# EasyEDA Pro project tumkibot1_relay_module.eprj

# Schematic Schematic1
Board Name: Board1; Create Date: 2025-09-21; Page Name: P1; Project Name: tumkibot1_relay_module; Schematic Name: Schematic1; Update Date: 2025-09-22; Company: EasyEDA.com; Page Size: A4; Version: V1.0
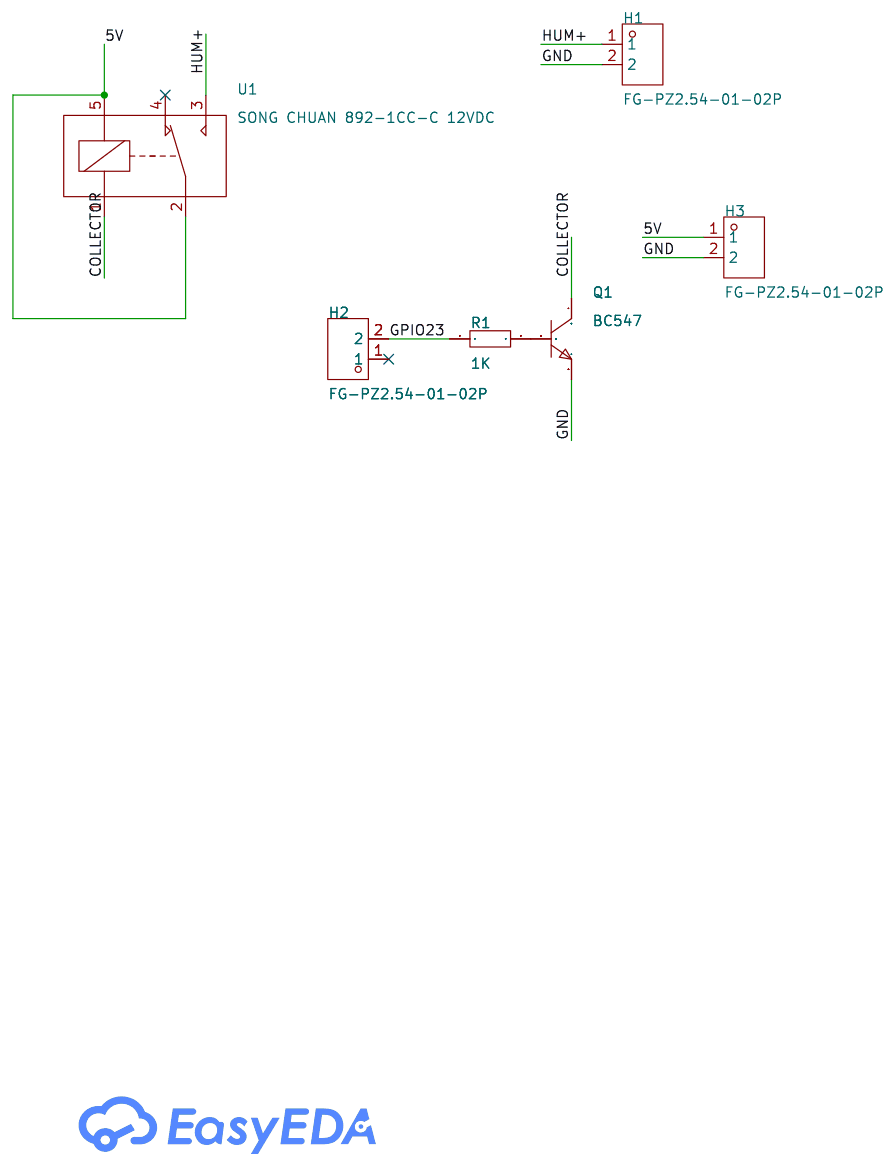
[diagram p0: schematic sheet]

## Parts
H1  FG-PZ2.54-01-02P  [HDR-TH_2P-P2.54-V-M]
H2  FG-PZ2.54-01-02P  [HDR-TH_2P-P2.54-V-M]
H3  FG-PZ2.54-01-02P  [HDR-TH_2P-P2.54-V-M]
Q1  BC547  [TO-92-3_L4.9-W3.7-P1.27-L]
R1  10K  [R0603]
U1  SONG CHUAN 892-1CC-C 12VDC  [RELAY_SPDT_892-1CC-C]

## Library data of the parts
H1-H3 = FG-PZ2.54-01-02P: LCSC Part Name: 1x2P 间距:2.54mm 方针; Supplier Part: C42391436; Manufacturer: FG(富港); Supplier Footprint: 插件,P=2.54mm; JLCPCB Part Class: Extended Part; Datasheet: https://item.szlcsc.com/datasheet/FG-PZ2.54-01-02P/44326031.html; Supplier: LCSC; Pin Structure: 1x2P; Pitch: 2.54mm; Circluar Pins/Square Pins: Pin Header; Number of Rows: 1
Q1 = BC547: Supplier Part: C47089404; Manufacturer: CJ(江苏长电/长晶); Supplier Footprint: TO-92; JLCPCB Part Class: Extended Part; Datasheet: https://item.szlcsc.com/datasheet/BC547/49277194.html; Supplier: LCSC; type: NPN; Current - Collector(Ic): 100mA; Collector - Emitter Voltage VCEO: 45V; Pd - Power Dissipation: 625mW; DC Current Gain: 800@5V,2mA; Transition frequency(fT): 150MHz; Current - Collector Cutoff: 100nA; Vce Saturation(VCE(sat)): 300mV@100mA,5mA; Operating Temperature: -55℃~+150℃; Emitter-Base Voltage(Vebo): 6V; Number: 1 NPN
R1 = Res_0603: Supplier Footprint: 0603
U1 = SONG CHUAN 892-1CC-C 12VDC: Supplier Part: C9900028967; Supplier Footprint: SPDT; Supplier: LCSC

## Nets
5V: H3.1 U1.2 U1.5
GND: H1.2 H3.2 Q1.3(E)
COLLECTOR: Q1.1(C) U1.1
GPIO23: H2.2 R1.1
HUM+: H1.1 U1.3
$1N469: Q1.2(B) R1.2

Not connected (* = marked no-connect by the designer): H2 1*; U1 4*

# Board PCB1
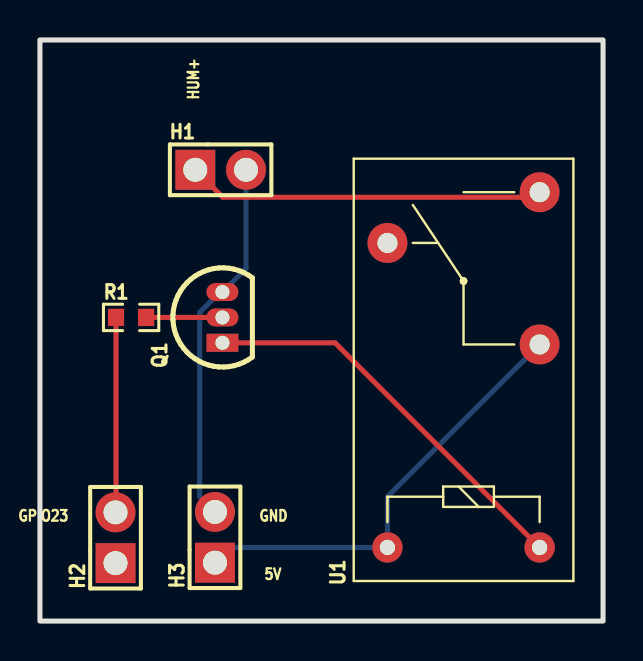
[diagram p1: board, top side]
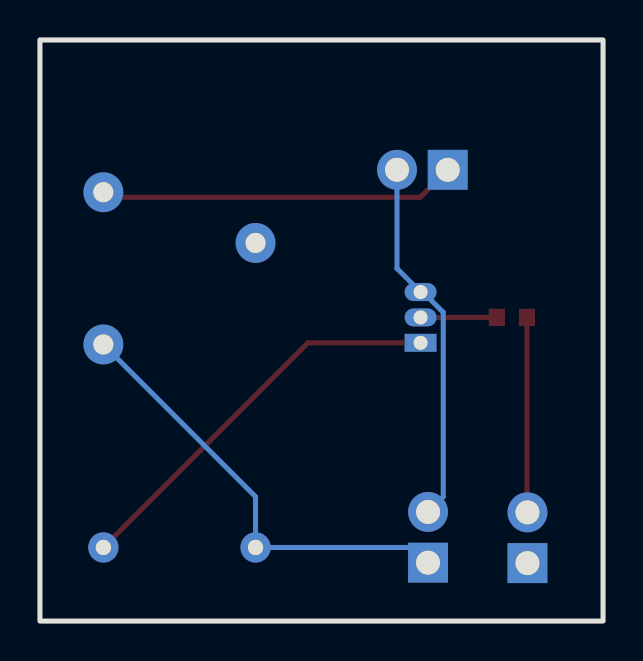
[diagram p2: board, bottom side, seen from below]

Outline 28.19 x 29.08 mm; copper layers: Top Layer, Bottom Layer. Coordinates in mm from the lower left corner of the outline.
Outline path: rectangle 0,29.08 28.19,0
Stack: Top Layer 0.035mm / Dielectric1 1.51mm FR4 er 4.5 / Bottom Layer 0.035mm

## Design rules (mm)
template: JLCPCB Capability(Two Layers Board)
spacing copperThickness1oz (default): track to track 0.102, other pairs 0.152 to 0.3
spacing copperThickness2oz: track to track 0.203, other pairs 0.152 to 0.3
track width copperThickness1oz (default): min 0.127, default 0.254, max 2.54
track width copperThickness2oz: min 0.203, default 0.254, max 2.54
differential pair differentialPair (default): width min 0.127, default 0.254, max 2.54; gap min 0.152, default 0.152
via viaSize (default): diameter min 0.5, default 0.61, max 10; hole min 0.3, default 0.305, max 6.3

## Placement (name value [footprint] x y rotation side)
H1  FG-PZ2.54-01-02P  [HDR-TH_2P-P2.54-V-M]  9.05 22.58 0 top
H2  FG-PZ2.54-01-02P  [HDR-TH_2P-P2.54-V-M]  3.78 4.17 90 top
H3  FG-PZ2.54-01-02P  [HDR-TH_2P-P2.54-V-M]  8.76 4.19 90 top
Q1  BC547  [TO-92-3_L4.9-W3.7-P1.27-L]  9.14 15.2 90 top
R1  10K  [R0603]  4.56 15.2 0 top
U1  SONG CHUAN 892-1CC-C 12VDC  [RELAY_SPDT_892-1CC-C]  21.21 12.57 90 top

## Footprints (pads in the part's own frame, mm; a bottom-side part is the same pattern mirrored in y, then rotated)
HDR-TH_2P-P2.54-V-M
  rect 2x2 hole 1.2: 1(-1.27,0)
  round 2 hole 1.2: 2(1.27,0)
R0603
  rect 0.806x0.864 smd: 1(-0.753,0) 2(0.753,0)
RELAY_SPDT_892-1CC-C
  round 1.52 hole 0.765x0.76: 1(-8.89,-3.81) 5(-8.89,3.81)
  round 2 hole 1.005x1: 2(1.27,-3.81) 3(8.89,-3.81) 4(6.35,3.81)
TO-92-3_L4.9-W3.7-P1.27-L
  rect 0.9x1.6 hole 0.7: 1(-1.27,0)
  oval 0.9x1.6 hole 0.7: 2(0,0) 3(1.27,0)

## Nets
As in the schematic.

Pads without a net: H2 1; U1 4

## Routing (per net, layer and track width the routed paths; a pad name or vN(x,y) marks a point on that pad's centre or on a via; arc(x,y) is an arc through that point)
5V: length 22.3
  Bottom Layer w0.254: U1.2 17.4,6.22 U1.5 9.53,3.68 H3.1
GND: length 18.5
  Bottom Layer w0.254: H3.2 8,6.22 8,15.45 9.02,16.47 Q1.3 10.32,17.65 10.32,22.58
COLLECTOR: length 20.1
  Top Layer w0.254: Q1.1 14.78,13.93 U1.1
GPIO23: length 9.8
  Top Layer w0.254: 3.81,15.2 3.81,5.47 H2.2
HUM+: length 17.9
  Top Layer w0.254: U1.3 24.77,21.21 9.15,21.21 H1.1
$1N469: length 3.8
  Top Layer w0.254: Q1.2 R1.2

## Text on the board
Top Silkscreen Layer: GPIO23 | GND | 5V | HUM+
